# Altium schematic sheet Sensor.SchDoc: =ProjectName
size A4; CheckedBy: DatNB; Author: Ven; CompanyName: Nacentech; Organization: IMET
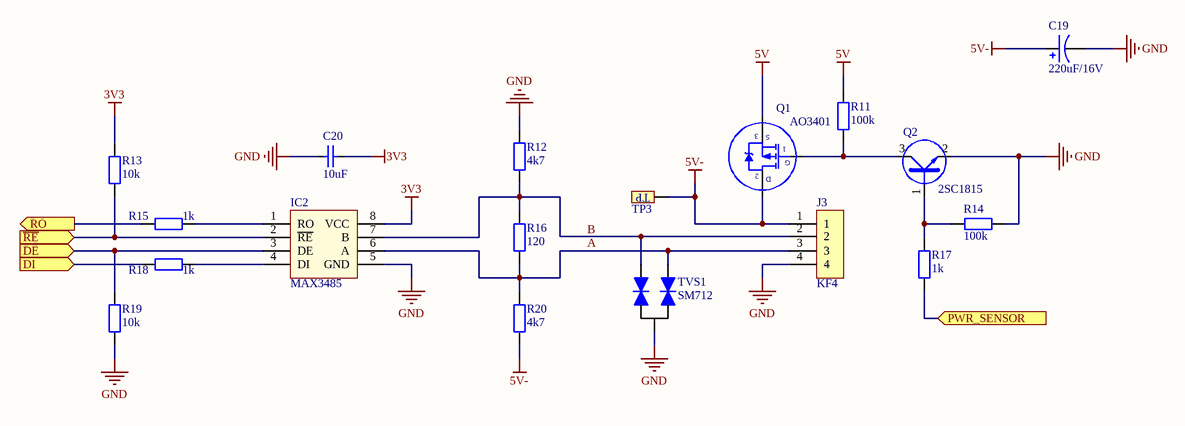
[diagram p0: Sensor.SchDoc]

## Parts
C19  220uF/16V  [C5mm]
C20  10uF  [CAP_0805]
IC2  MAX3485  [SO-8]
J3  KF4  [KF4-5.08]
Q1  AO3401  [SOT23A]
Q2  2SC1815  [SOT23D]
R11  100k  [RES-SMD-0805]
R12  4k7  [RES-SMD-0805]
R13  10k  [RES-SMD-0805]
R14  100k  [RES-SMD-0805]
R15  1k  [RES-SMD-0805]
R16  120  [RES-SMD-0805]
R17  1k  [RES-SMD-0805]
R18  1k  [RES-SMD-0805]
R19  10k  [RES-SMD-0805]
R20  4k7  [RES-SMD-0805]
TP3  Test Point  [TP_SMD]  (value not drawn)
TVS1  SM712  [SOT23]

## Ports
DE (in), DI (in), PWR_SENSOR (in), RO (out), ~{RE} (in)

## Nets
3V3: C20.2 IC2.8(VCC) R13.1
5V: Q1.3(S) R11.1
5V-: C19.1 J3.1 Q1.2(D) R20.1 TP3.1
GND: C19.2 C20.1 IC2.5(GND) J3.4 Q2.2(E) R12.2 R14.2 R19.2 TVS1.3(K)
A: IC2.6(A) J3.3 R16.1 R20.2 TVS1.1(A)
DE: IC2.3(DE) R19.1 ; port DE
DI: R18.2 ; port DI
PWR_SENSOR: R17.2 ; port PWR_SENSOR
~{RE}: IC2.2(~{RE}) R13.2 ; port ~{RE}
RO: R15.2 ; port RO
NetIC2_1: IC2.1(RO) R15.1
NetIC2_4: IC2.4(DI) R18.1
NetIC2_7: IC2.7(B) J3.2 R12.1 R16.2 TVS1.2(A)
NetQ1_1: Q1.1(G) Q2.3(C) R11.2
NetQ2_1: Q2.1(B) R14.1 R17.1

## Notes on the sheet
- Labels drawn without touching a wire or pin: B
- Project:
- Page Contents:
- Size:
- Date:
- A4
- Checked by:
- Time:
- Revision:
- Sheet
- of
- File:

## Library data of the parts
C19 = Cap Pol: Polarized Capacitor (Axial); Published: 8-Jun-2000; LatestRevisionDate: 17-Jul-2002; LatestRevisionNote: Re-released for DXP Platform.; PackageReference: POLAR0.8; Publisher: Altium Limited
C20 = CapSMD: Capacitor; Value: 33p; Published: 8-Jun-2000; LatestRevisionDate: 17-Jul-2002; LatestRevisionNote: Re-released for DXP Platform.; PackageReference: RAD-0.3; Publisher: Altium Limited
IC2 = MAX485: RS232 - RS485 (Same sn75176)
J3 = KF4: Manufacturer: W¨¹rth Elektronik eiSos GmbH; PartNo: 691133710004; ComponentLink1 Description: Manufacturer; ComponentLink2 Description: Datasheet; NoPins: 4; ComponentLink1 URL: http://www.we-online.com; ComponentLink2 URL: http://katalog.we-online.de/em/datasheet/6911337100xx.pdf; Created By: Baojun Chen; Created Date: 4-Aug-15
Q1 = MOSFET_P: 30V 5.8A P-Channel MOSFET
Q2 = C1815: NPN 600mW, ECB; Value: C1815
R11-R20 = Resistor - SMD: Resistor SMD; Manufacturer: Generic Components; Class: Passive; Published: 08/06/2000; Publisher: Altium Hobart Technology Centre
TP3 = TP: CONNECT 1
TVS1 = BAV70: Value: 1N4148